# Altium schematic sheet BC-MPR Interface.SchDoc
size A4; Organization: TESLA Motors, INC; Address1: 3500 Deer Creek Road; Address2: Palo Alto, CA; Address4: U.S.A.; SheetNumber: 7; SheetTotal: 13
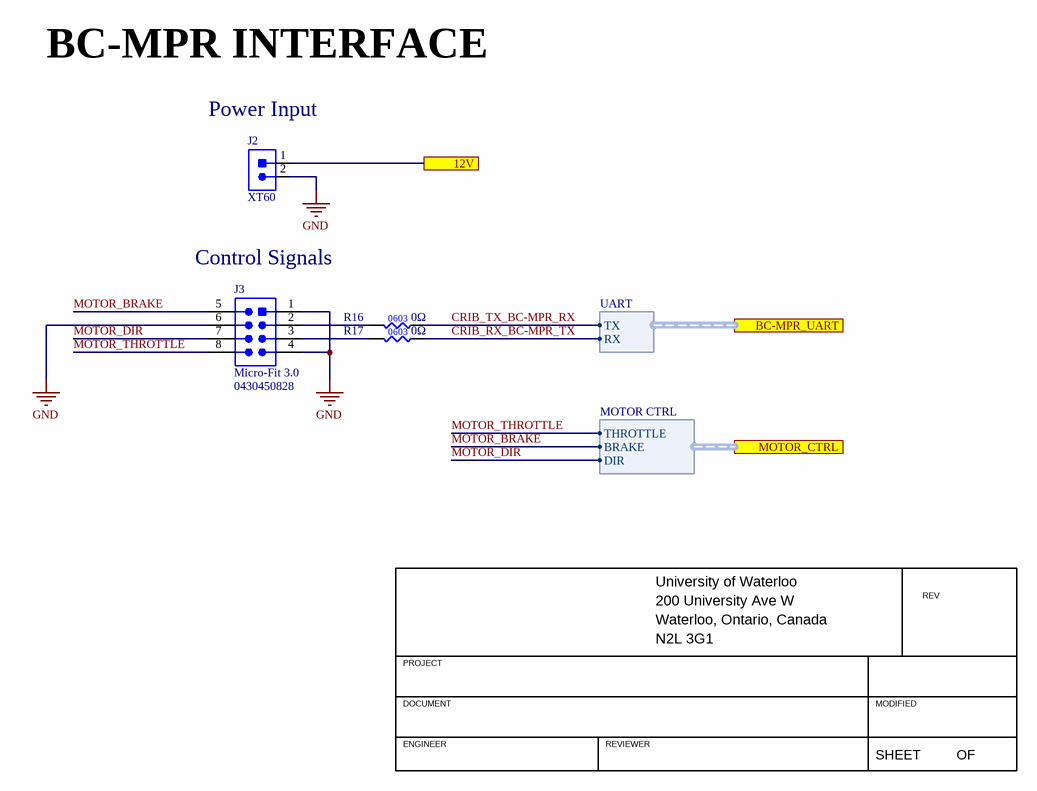
[diagram p0: BC-MPR Interface.SchDoc]

## Parts
J2  CON_2POS_XT60  [XT60]  (value not drawn)
J3  Family: Micro-Fit 3.0  [MOLEX-0430450828]  (hidden comment: 0430450828)
R16  value 0Ω  [RES0603]  (hidden comment: RES_0Ω_0603)
R17  value 0Ω  [RES0603]  (hidden comment: RES_0Ω_0603)

## Ports
12V (see Top[1A]), BC-MPR_UART (harness UART, see Top[1A], STM32 MCU[1A]), MOTOR_CTRL (harness MOTOR CTRL, see Top[1A], STM32 MCU[1A])

## Harnesses
UART: TX, RX
MOTOR CTRL: THROTTLE, BRAKE, DIR

## Nets
GND: J2.2 J3.1 J3.4 J3.6
12V: J2.1 ; port 12V
CRIB_RX_BC-MPR_TX: R17.1 ; port BC-MPR_UART.RX
CRIB_TX_BC-MPR_RX: R16.1 ; port BC-MPR_UART.TX
MOTOR_BRAKE: J3.5 ; port MOTOR_CTRL.BRAKE
MOTOR_DIR: J3.7 ; port MOTOR_CTRL.DIR
MOTOR_THROTTLE: J3.8 ; port MOTOR_CTRL.THROTTLE
NetJ3_2: J3.2 R16.2
NetJ3_3: J3.3 R17.2

## Notes on the sheet
- BC-MPR INTERFACE
- (near J2) Power Input
- Control Signals
- University of Waterloo
- 200 University Ave W
- REV
- PROJECT
- Waterloo, Ontario, Canada
- N2L 3G1
- DOCUMENT
- ENGINEER
- REVIEWER
- MODIFIED
- SHEET
- OF

## Library data of the parts
J2 = CON_2POS_XT60: XT60 CONNECTORS MALE/FEMALE PAIR; Manufacturer 1: SparkFun Electronics; Manufacturer Part Number 1: PRT-10474; Mounting Type: TH; Package/Footprint: XT60; Supplier 1: Digi-Key; Supplier Part Number 1: 1568-1816-ND
J3 = CON_MOLEX-HDR_4x2_TH: CONN HEADER VERT 8POS 3MM; Manufacturer 1: Molex; Voltage Rating: 250VAC; Current Rating: 5A; Pitch: 3mm; Supplier 1: Digi-Key; Supplier Part Number 1: WM10693-ND; Manufacturer Part Number 1: 0430450828
R16 R17 = RES_0Ω_0603: RES 0 OHM JUMPER 1/10W 0603; Manufacturer 1: Yageo; Manufacturer Part Number 1: RC0603JR-070RL; Supplier Part Number 1: 311-0.0GRCT-ND; Supplier 1: Digi-Key; Mounting Type: SMD; Package: 0603